# Altium schematic sheet CAMERA.SchDoc: Air724UG 参考设计
size 594 x 419 mm; DESIGNER: Loukanghua; REV: V1.0
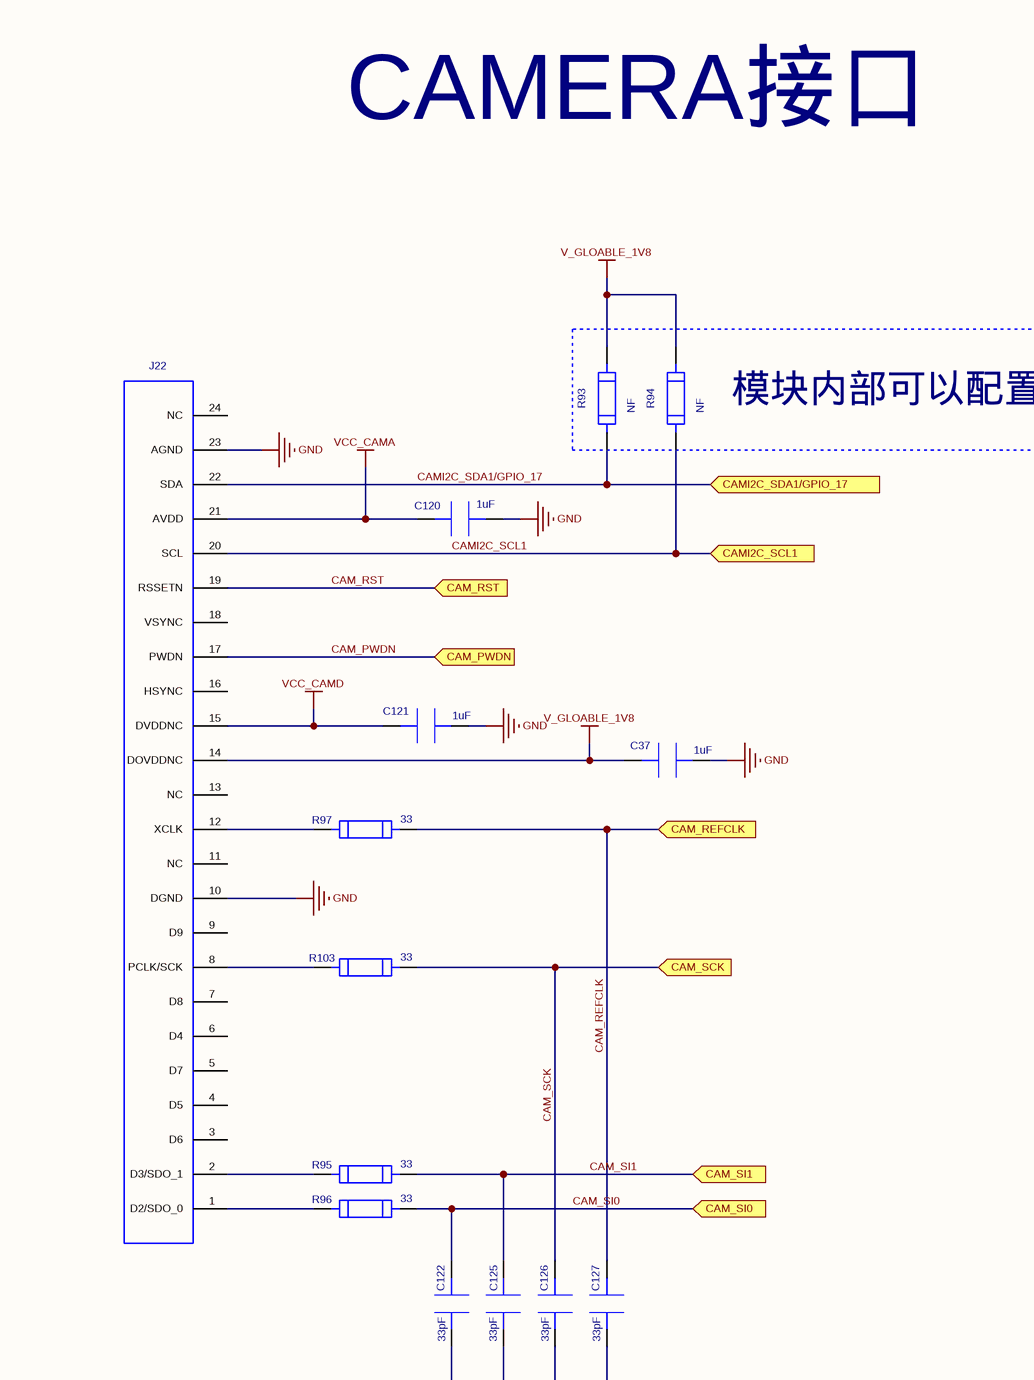
[diagram p0: CAMERA.SchDoc, top left]
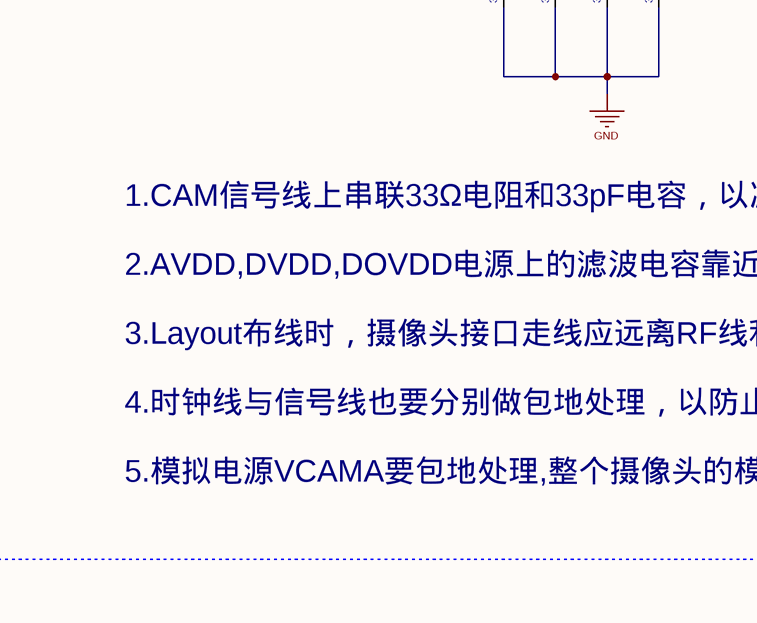
[diagram p1: CAMERA.SchDoc, bottom left]
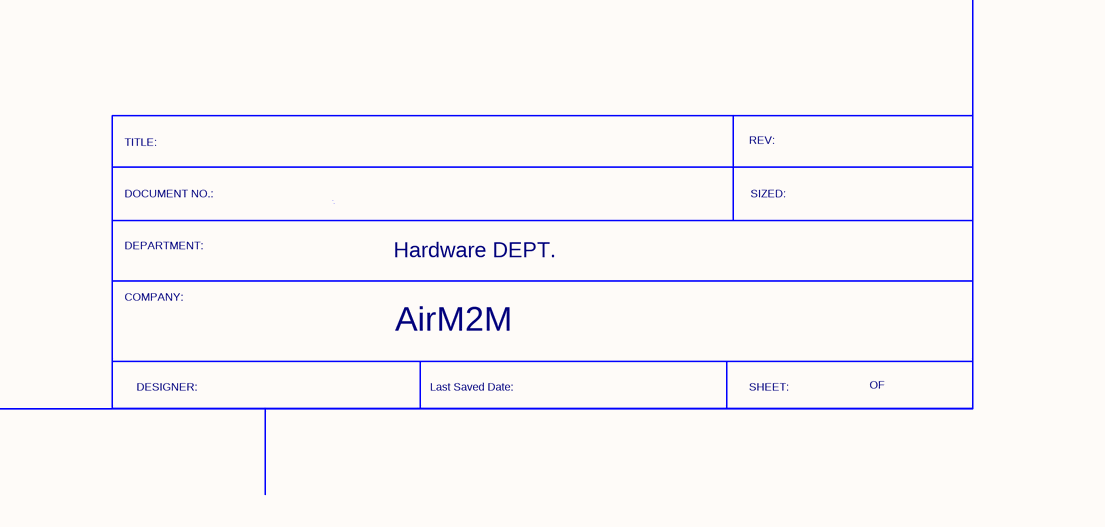
[diagram p2: CAMERA.SchDoc, bottom right]

## Parts
C37  value 1uF  [SC0402]  (hidden comment: CAP-1UF-0402-X5R)
C120  value 1uF  [SC0402]  (hidden comment: CAP-1UF-0402-X5R)
C121  value 1uF  [SC0402]  (hidden comment: CAP-1UF-0402-X5R)
C122  value 33pF  [SC0402]  (hidden comment: CAP-33PF-0402-C0G)
C125  value 33pF  [SC0402]  (hidden comment: CAP-33PF-0402-C0G)
C126  value 33pF  [SC0402]  (hidden comment: CAP-33PF-0402-C0G)
C127  value 33pF  [SC0402]  (hidden comment: CAP-33PF-0402-C0G)
J22  FPC-24PIN-0.5MM-Y  [FPC-24PIN-0.5MM]  (value not drawn)
R93  value NF  [SR0402-NF]  (hidden comment: RES-0402-NF)
R94  value NF  [SR0402-NF]  (hidden comment: RES-0402-NF)
R95  value 33  [SR0402]  (hidden comment: RES-22-0402)
R96  value 33  [SR0402]  (hidden comment: RES-22-0402)
R97  value 33  [SR0402]  (hidden comment: RES-22-0402)
R103  value 33  [SR0402]  (hidden comment: RES-22-0402)

## Blocks framed on the sheet
CAMERA接口: C37 C120-C122 C125-C127 J22 R95-R97 R103
模块内部可以配置I2C 上拉，外部可以不贴: R93 R94

## Ports
CAM_PWDN, CAM_REFCLK, CAM_RST, CAM_SCK, CAM_SI0, CAM_SI1, CAMI2C_SCL1, CAMI2C_SDA1/GPIO_17

## Nets
GND: C37.2 C120.1 C121.2 C122.1 C125.1 C126.1 C127.1 J22.10(DGND) J22.23(AGND) J22.25(GND) J22.26(GND)
V_GLOABLE_1V8: C37.1 J22.14(DOVDDNC) R93.2 R94.2
VCC_CAMA: C120.2 J22.21(AVDD)
VCC_CAMD: C121.1 J22.15(DVDDNC)
CAM_PWDN: J22.17(PWDN) ; port CAM_PWDN
CAM_REFCLK: C127.2 R97.2 ; port CAM_REFCLK
CAM_RST: J22.19(RSSETN) ; port CAM_RST
CAM_SCK: C126.2 R103.2 ; port CAM_SCK
CAM_SI0: C122.2 R96.2 ; port CAM_SI0
CAM_SI1: C125.2 R95.2 ; port CAM_SI1
CAMI2C_SCL1: J22.20(SCL) R94.1 ; port CAMI2C_SCL1
CAMI2C_SDA1/GPIO_17: J22.22(SDA) R93.1 ; port CAMI2C_SDA1/GPIO_17
NetJ22_1: J22.1(D2/SDO_0) R96.1
NetJ22_2: J22.2(D3/SDO_1) R95.1
NetJ22_8: J22.8(PCLK/SCK) R103.1
NetJ22_12: J22.12(XCLK) R97.1

Not connected (* = marked no-connect by the designer): J22 3(D6) 4(D5) 5(D7) 6(D4) 7(D8) 9(D9) 11(NC) 13(NC) 16(HSYNC) 18(VSYNC) 24(NC)

## Notes on the sheet
- 1.CAM信号线上串联33Ω电阻和33pF电容，以减小射频干扰。
- 2.AVDD,DVDD,DOVDD电源上的滤波电容靠近连接器端摆放。
- 3.Layout布线时，摄像头接口走线应远离RF线和VBAT电源线，尤其是时钟线与信号线。
- 4.时钟线与信号线也要分别做包地处理，以防止干扰。
- 5.模拟电源VCAMA要包地处理,整个摄像头的模拟部分是由VCAMA供电。
- TITLE:
- REV:
- DEPARTMENT:
- DOCUMENT NO.:
- Hardware DEPT.
- SIZED:
- COMPANY:
- AirM2M
- DESIGNER:
- Last Saved Date:
- SHEET:
- OF

## Library data of the parts
C37 C120 C121 = CAP-1UF-0402-X5R: CAP CER X5R;1uF;+/-10%;6.3V;0402;0.5mm;ROHS; Manufacture 1 P/N: GRM155R60J105K****;CC0402KRX5R5BB105;C1005X5R0J105KT;JMK105BJ105KV-F;ECJ0EB0J105K;0402X105K6R3CT;CL05A105KQ5NNNC; Manufacture 1: Murata;Yageo;TDK;Taiyo Yuden;Panasonic;Walsin;Samsung; Serial Number: 80214710001; Geometry.Height: 0.55mm; Tolerance: +/-10%; PCB DECAL: SC0402
C122 C125-C127 = CAP-33PF-0402-C0G: CAP CER C0G;33PF;+/-5%;50V;0402;0.5mm;ROHS; Manufacture 1: MURATA;Yageo;Eyang; Manufacture 1 P/N: GRM1555C1H330J****;CC0402JRNPO9BN330;C0402C0G330J500N*; Geometry.Height: 0.55mm; Serial Number: 80214650008; Tolerance: +/-5%; PCB DECAL: SC0402
J22 = FPC-24PIN-0.5MM-Y: Geometry.Height: 2.0mm; PCB DECAL: FPC-24PIN-0.5MM
R93 R94 = RES-0402-NF: NF; Geometry.Height: 0.4mm; Tolerance: +/-5%; Serial Number: NF; Manufacture 1 P/N: NF; Manufacture 1: NF; PCB DECAL: SR0402-NF
R95-R97 R103 = RES-22-0402: RES FILM;22;+/-5%;1/16W;0402;0.4mm;ROHS; Manufacture 1 P/N: RC0402JR-0722RL; Manufacture 1: YAGEO; Serial Number: 80114640035; Geometry.Height: 0.4mm; Tolerance: +/-5%; PCB DECAL: SR0402